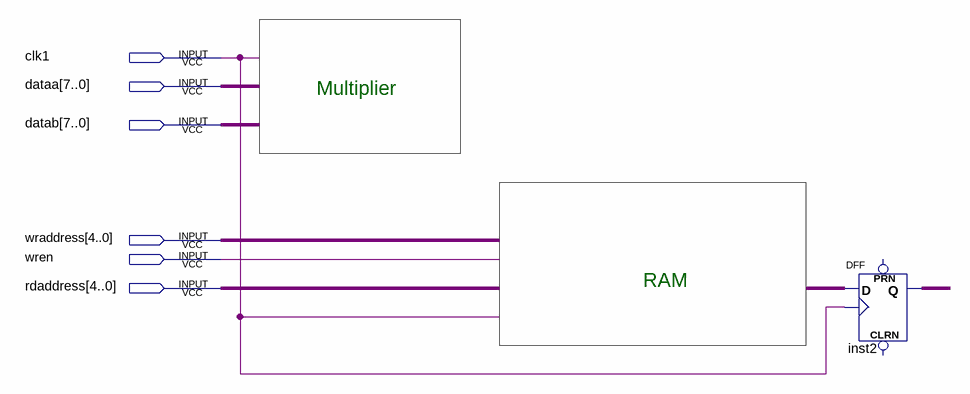
[diagram p0: schematic sheet]
// Quartus schematic pipemult.bdf as structural Verilog: 1 symbols, 6 pins
module pipemult (
  input  clk1,
  input  [7:0] dataa,
  input  [7:0] datab,
  input  [4:0] wraddress,
  input  wren,
  input  [4:0] rdaddress
);

  wire inst2_q, undriven;

  DFF inst2 (.CLK(clk1), .D(undriven), .Q(inst2_q));  // open: CLRN, PRN

  // Notes on the sheet:
  //   Multiplier
  //   RAM
endmodule
